# Altium schematic sheet Sheet1.SchDoc
size A4
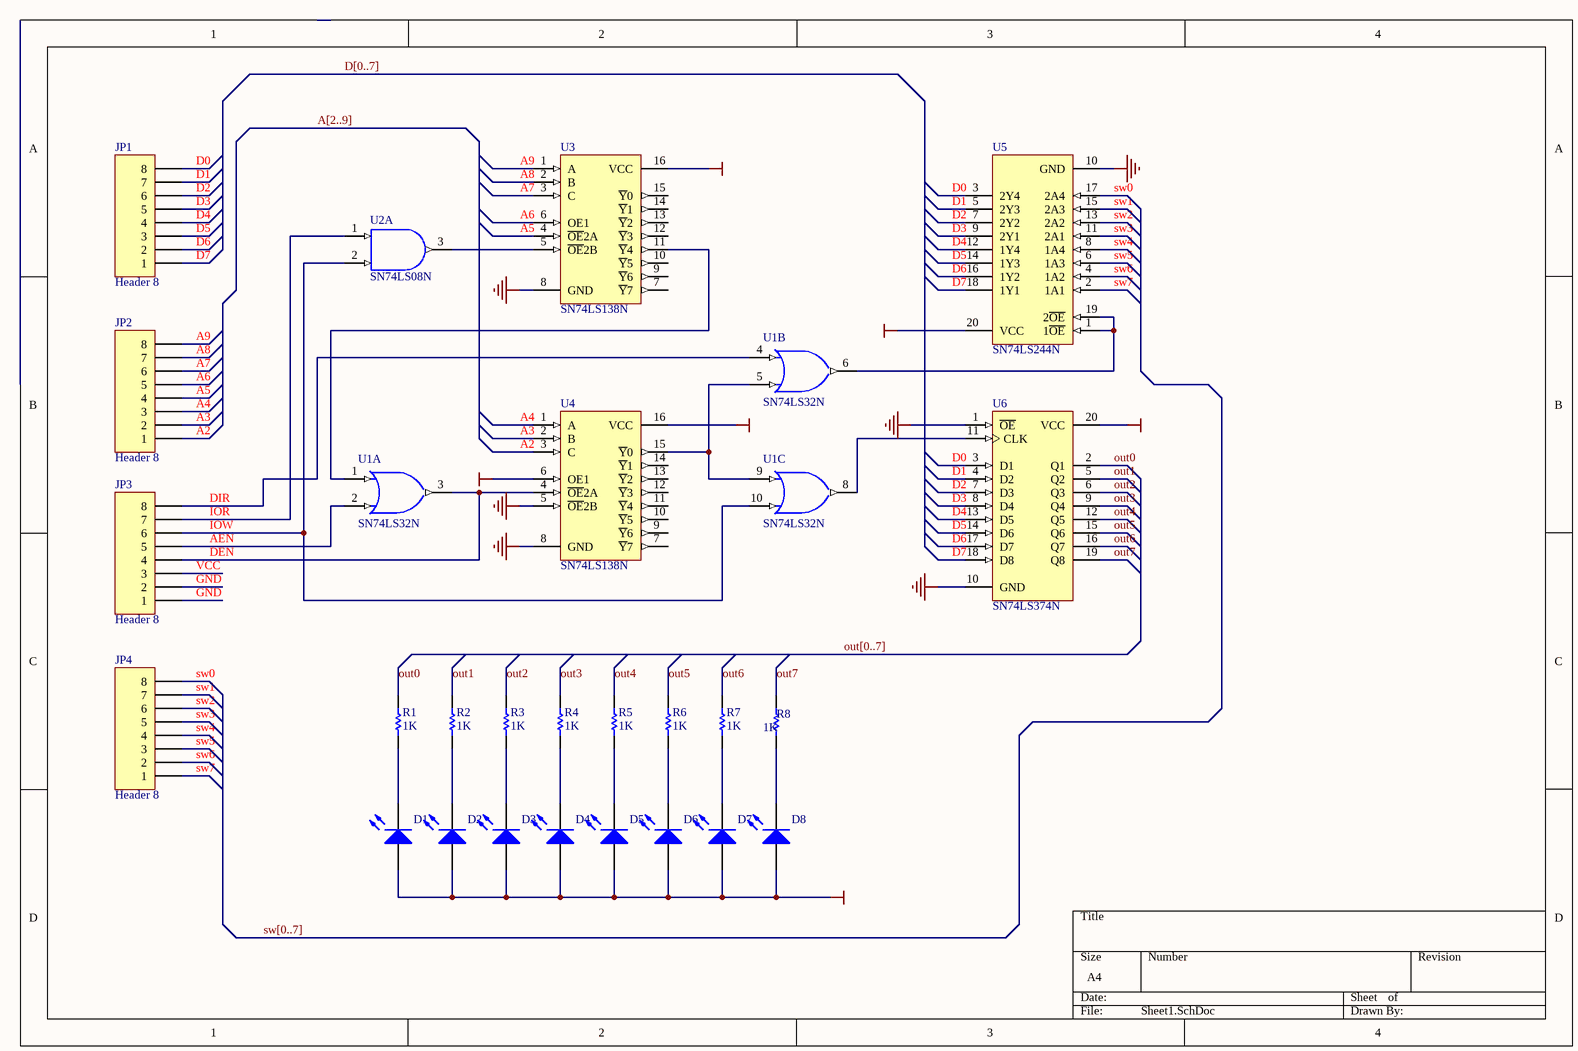
[diagram p0: Sheet1.SchDoc]

## Parts
D1  LED1  [LED-1]  (value not drawn)
D2  LED1  [LED-1]  (value not drawn)
D3  LED1  [LED-1]  (value not drawn)
D4  LED1  [LED-1]  (value not drawn)
D5  LED1  [LED-1]  (value not drawn)
D6  LED1  [LED-1]  (value not drawn)
D7  LED1  [LED-1]  (value not drawn)
D8  LED1  [LED-1]  (value not drawn)
JP1  Header 8  [HDR1X8]
JP2  Header 8  [HDR1X8]
JP3  Header 8  [HDR1X8]
JP4  Header 8  [HDR1X8]
R1  value 1K  [AXIAL-0.3]  (hidden comment: Res1)
R2  value 1K  [AXIAL-0.3]  (hidden comment: Res1)
R3  value 1K  [AXIAL-0.3]  (hidden comment: Res1)
R4  value 1K  [AXIAL-0.3]  (hidden comment: Res1)
R5  value 1K  [AXIAL-0.3]  (hidden comment: Res1)
R6  value 1K  [AXIAL-0.3]  (hidden comment: Res1)
R7  value 1K  [AXIAL-0.3]  (hidden comment: Res1)
R8  value 1K  [AXIAL-0.3]  (hidden comment: Res1)
U1  SN74LS32N  [N014]  (parts A,B,C of 4)
U2  SN74LS08N  [N014]  (part A of 4)
U3  SN74LS138N  [N016]
U4  SN74LS138N  [N016]
U5  SN74LS244N  [N020]
U6  SN74LS374N  [N020D]

## Nets
GND: JP3.1 JP3.2 U1.7(GND) U2.7(GND) U3.8(GND) U4.5(~{OE}2B) U4.8(GND) U5.10(GND) U6.1(~{OE}) U6.10(GND)
VCC: D1.1(A) D2.1(A) D3.1(A) D4.1(A) D5.1(A) D6.1(A) D7.1(A) D8.1(A) JP3.3 U1.14(VCC) U2.14(VCC) U3.16(VCC) U4.6(OE1) U4.16(VCC) U5.20(VCC) U6.20(VCC)
A2: JP2.1 U4.3(C)
A3: JP2.2 U4.2(B)
A4: JP2.3 U4.1(A)
A5: JP2.4 U3.4(~{OE}2A)
A6: JP2.5 U3.6(OE1)
A7: JP2.6 U3.3(C)
A8: JP2.7 U3.2(B)
A9: JP2.8 U3.1(A)
AEN: JP3.5 U1.2(B)
D0: JP1.8 U5.3(2Y4) U6.3(D1)
D1: JP1.7 U5.5(2Y3) U6.4(D2)
D2: JP1.6 U5.7(2Y2) U6.7(D3)
D3: JP1.5 U5.9(2Y1) U6.8(D4)
D4: JP1.4 U5.12(1Y4) U6.13(D5)
D5: JP1.3 U5.14(1Y3) U6.14(D6)
D6: JP1.2 U5.16(1Y2) U6.17(D7)
D7: JP1.1 U5.18(1Y1) U6.18(D8)
DEN: JP3.4 U1.3(Y) U4.4(~{OE}2A)
DIR: JP3.8 U1.4(A)
IOR: JP3.7 U2.1(A)
IOW: JP3.6 U1.10(B) U2.2(B)
out0: R1.1 U6.2(Q1)
out1: R2.2 U6.5(Q2)
out2: R3.2 U6.6(Q3)
out3: R4.2 U6.9(Q4)
out4: R5.2 U6.12(Q5)
out5: R6.2 U6.15(Q6)
out6: R7.2 U6.16(Q7)
out7: R8.2 U6.19(Q8)
sw0: JP4.8 U5.17(2A4)
sw1: JP4.7 U5.15(2A3)
sw2: JP4.6 U5.13(2A2)
sw3: JP4.5 U5.11(2A1)
sw4: JP4.4 U5.8(1A4)
sw5: JP4.3 U5.6(1A3)
sw6: JP4.2 U5.4(1A2)
sw7: JP4.1 U5.2(1A1)
NetD1_2: D1.2(K) R1.2
NetD2_2: D2.2(K) R2.1
NetD3_2: D3.2(K) R3.1
NetD4_2: D4.2(K) R4.1
NetD5_2: D5.2(K) R5.1
NetD6_2: D6.2(K) R6.1
NetD7_2: D7.2(K) R7.1
NetD8_2: D8.2(K) R8.1
NetU1_1: U1.1(A) U3.11(~{Y}4)
NetU1_5: U1.5(B) U1.9(A) U4.15(~{Y}0)
NetU1_6: U1.6(Y) U5.1(1~{OE}) U5.19(2~{OE})
NetU1_8: U1.8(Y) U6.11(CLK)
NetU2_3: U2.3(Y) U3.5(~{OE}2B)

Not connected (* = marked no-connect by the designer): U3 7(~{Y}7) 9(~{Y}6) 10(~{Y}5) 12(~{Y}3) 13(~{Y}2) 14(~{Y}1) 15(~{Y}0); U4 7(~{Y}7) 9(~{Y}6) 10(~{Y}5) 11(~{Y}4) 12(~{Y}3) 13(~{Y}2) 14(~{Y}1)

## Buses and harness runs
bus A[2..9]
bus D[0..7]
bus out[0..7]
bus sw[0..7]

## Library data of the parts
D1-D8 = LED1: Typical RED GaAs LED; Published: 8-Jun-2000; LatestRevisionDate: 17-Jul-2002; LatestRevisionNote: Re-released for DXP Platform.; Publisher: Altium Limited
JP1-JP4 = Header 8: Header, 8-Pin; LatestRevisionDate: 17-Jul-2002; LatestRevisionNote: Re-released for DXP Platform.; Publisher: Altium Limited
R1-R8 = Res1: Resistor; Published: 8-Jun-2000; LatestRevisionDate: 17-Jul-2002; LatestRevisionNote: Re-released for DXP Platform.; Publisher: Altium Limited
U1 = SN74LS32N: Quadruple 2-Input Positive-OR Gate; Published: 8-Jun-2000; LatestRevisionDate: 17-Jul-2002; LatestRevisionNote: Re-released for DXP Platform.; DatasheetDocument: Mar-1988; PackageDocument: Oct-1995; PackageReference: N014; Publisher: Altium Limited
U2 = SN74LS08N: Quadruple 2-Input Positive-AND Gate; Published: 8-Jun-2000; LatestRevisionDate: 17-Jul-2002; LatestRevisionNote: Re-released for DXP Platform.; DatasheetDocument: Mar-1988; PackageDocument: Oct-1995; PackageReference: N014; Publisher: Altium Limited
U3 U4 = SN74LS138N: 3-Line to 8-Line Decoder / Demultiplexer; Published: 8-Jun-2000; LatestRevisionDate: 17-Jul-2002; LatestRevisionNote: Re-released for DXP Platform.; DatasheetDocument: Mar-1988; PackageDocument: Oct-1995; PackageReference: N016; Publisher: Altium Limited; Code_JEDEC: MS-001-BB
U5 = SN74LS244N: Octal Buffer and Line Driver with 3-State Outputs; Published: 8-Jun-2000; LatestRevisionDate: 17-Jul-2002; LatestRevisionNote: Re-released for DXP Platform.; DatasheetDocument: Mar-1988; PackageDocument: Oct-1995; PackageReference: N020; Publisher: Altium Limited
U6 = SN74LS374N: Octal D-Type Transparent Latches and Edge-Triggered Flip-Flop; Published: 8-Jun-2000; LatestRevisionDate: 17-Jul-2002; LatestRevisionNote: Re-released for DXP Platform.; DatasheetDocument: Mar-1988; PackageDocument: Oct-1995; PackageReference: N020D; Publisher: Altium Limited